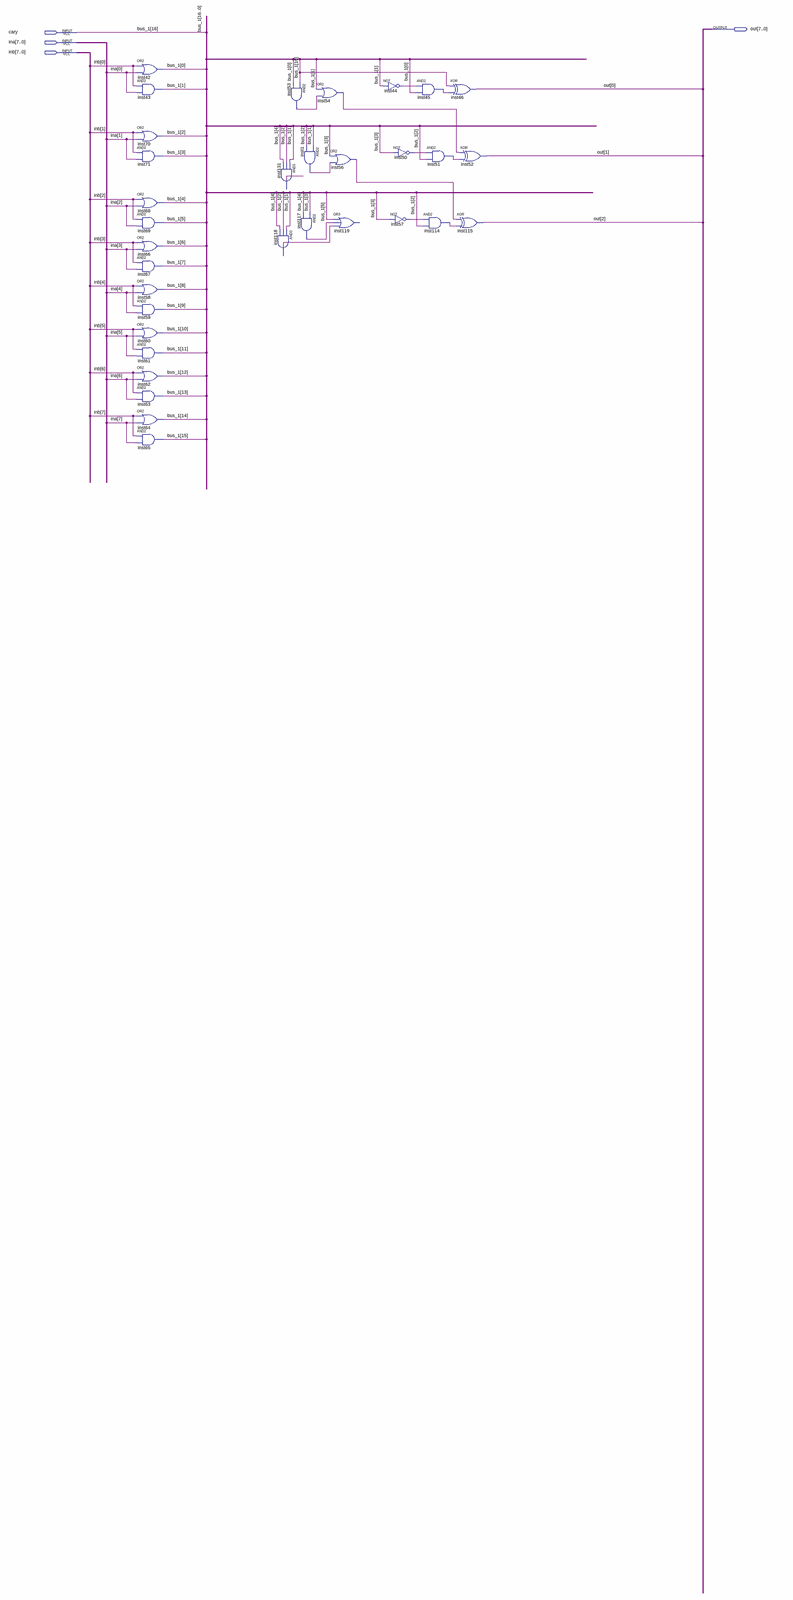
[diagram p0: schematic sheet, whole]
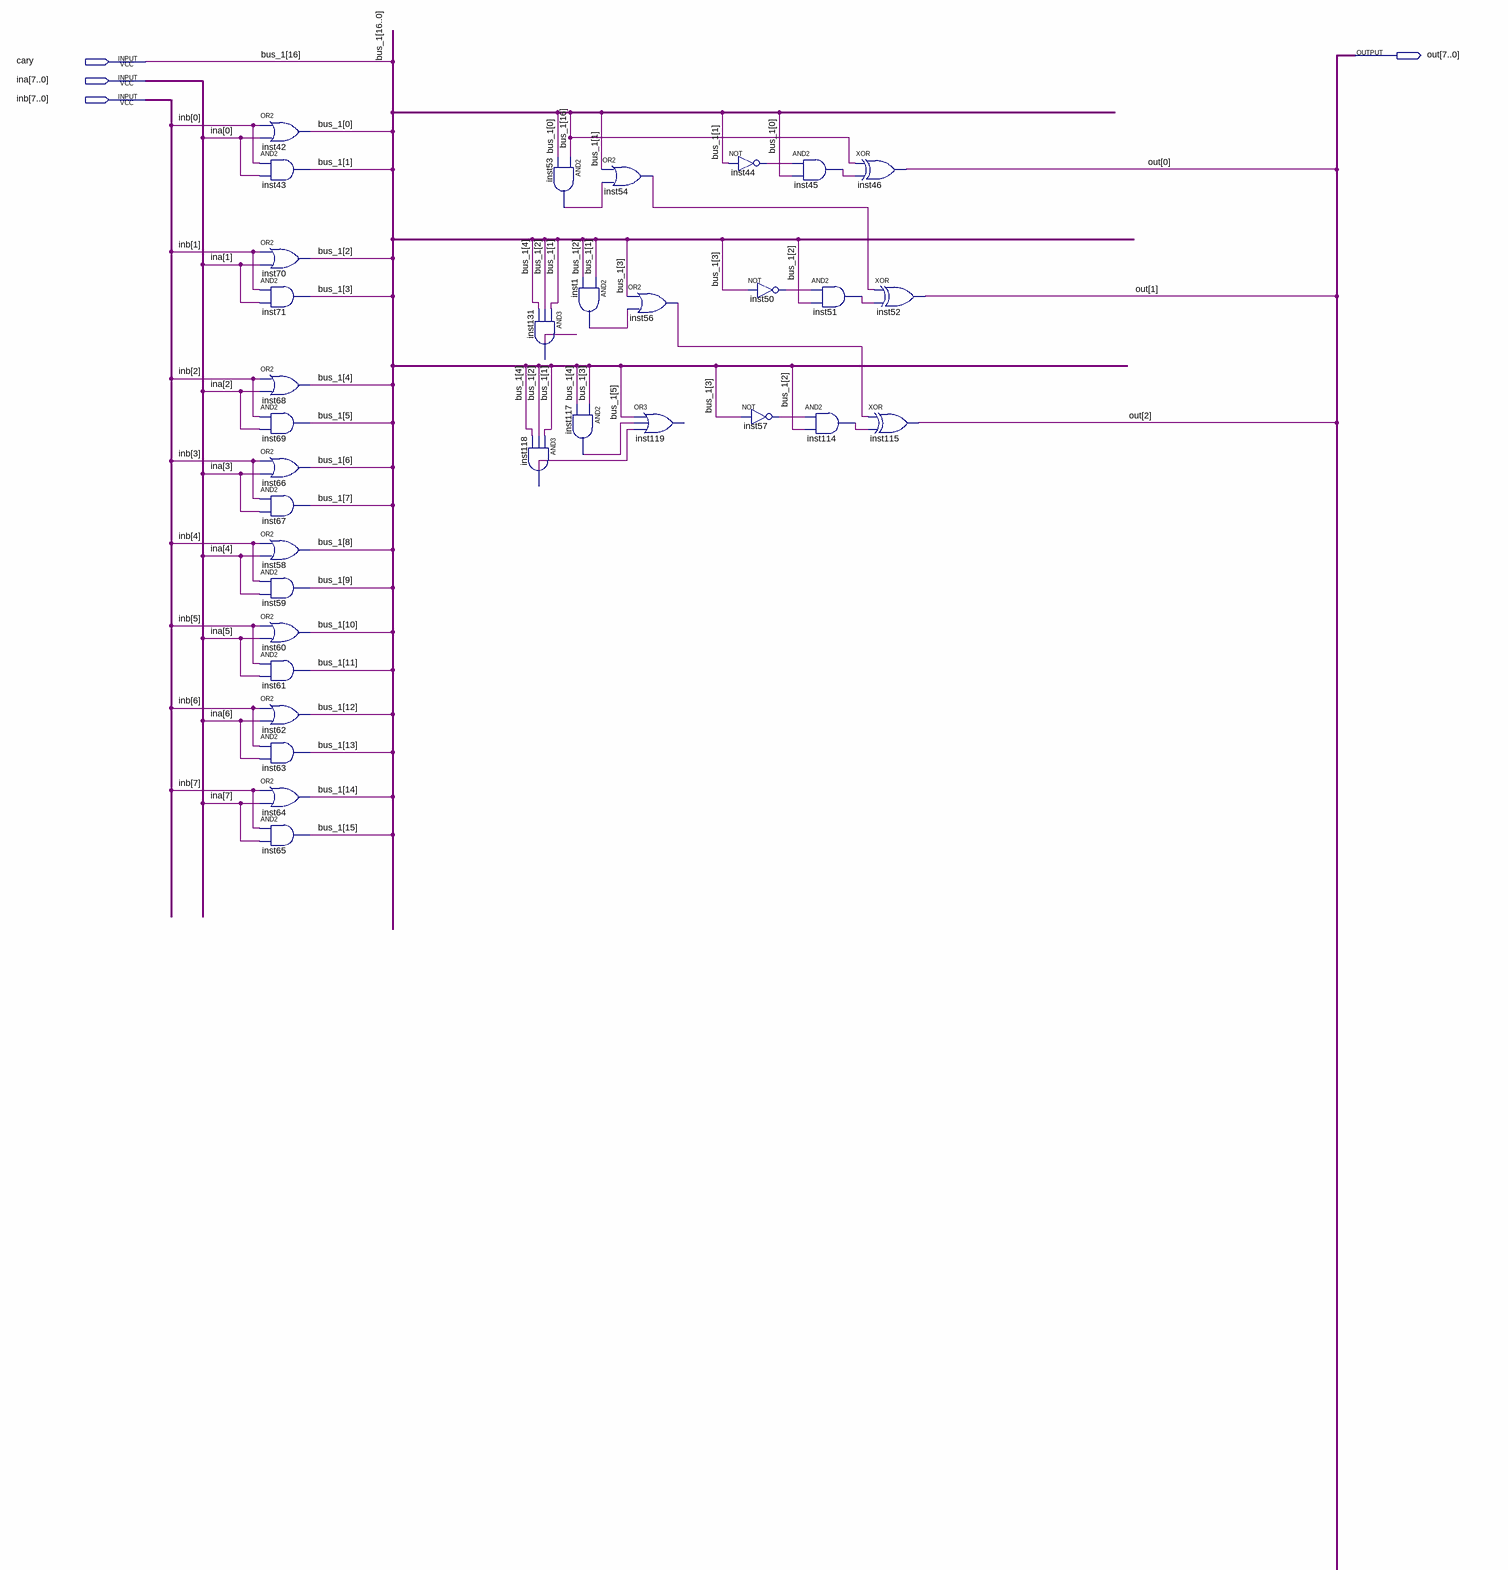
[diagram p1: schematic sheet, upper part]
// Quartus schematic adder32_1.bdf as structural Verilog: 33 symbols, 4 pins
module adder32_1 (
  input  cary,
  input  [7:0] ina,
  input  [7:0] inb,
  output [7:0] out
);

  wire inst1_out, inst44_out, inst45_out, inst50_out, inst51_out, inst53_out, inst54_out, inst56_out,
       inst57_out, inst114_out, inst117_out, inst118_out, inst131_out;
  wire [15:0] bus_1;

  or inst42 (bus_1[0], inb[0], ina[0]);
  and inst43 (bus_1[1], inb[0], ina[0]);
  or inst70 (bus_1[2], inb[1], ina[1]);
  and inst71 (bus_1[3], inb[1], ina[1]);
  or inst68 (bus_1[4], inb[2], ina[2]);
  and inst69 (bus_1[5], inb[2], ina[2]);
  or inst66 (bus_1[6], inb[3], ina[3]);
  and inst67 (bus_1[7], inb[3], ina[3]);
  or inst58 (bus_1[8], inb[4], ina[4]);
  and inst59 (bus_1[9], inb[4], ina[4]);
  or inst60 (bus_1[10], inb[5], ina[5]);
  and inst61 (bus_1[11], inb[5], ina[5]);
  or inst62 (bus_1[12], inb[6], ina[6]);
  and inst63 (bus_1[13], inb[6], ina[6]);
  or inst64 (bus_1[14], inb[7], ina[7]);
  and inst65 (bus_1[15], inb[7], ina[7]);
  and inst53 (inst53_out, cary, bus_1[0]);
  and inst131 (inst131_out, bus_1[1], bus_1[2], bus_1[4]);
  and inst117 (inst117_out, bus_1[3], bus_1[4]);
  and inst118 (inst118_out, bus_1[1], bus_1[2], bus_1[4]);
  or inst54 (inst54_out, bus_1[1], inst53_out);
  and inst1 (inst1_out, bus_1[1], bus_1[2]);
  or inst56 (inst56_out, bus_1[3], inst1_out);
  // OR3 inst119 has open pins: IN1=bus_1[5], IN2=inst117_out, IN3=inst118_out, OUT=open
  not inst44 (inst44_out, bus_1[1]);
  not inst50 (inst50_out, bus_1[3]);
  not inst57 (inst57_out, bus_1[3]);
  and inst45 (inst45_out, inst44_out, bus_1[0]);
  and inst51 (inst51_out, inst50_out, bus_1[2]);
  and inst114 (inst114_out, inst57_out, bus_1[2]);
  xor inst46 (out[0], cary, inst45_out);
  xor inst115 (out[2], inst56_out, inst114_out);
  xor inst52 (out[1], inst54_out, inst51_out);

  // Other names for the same wires on the sheet: bus_1[16] = cary
endmodule
